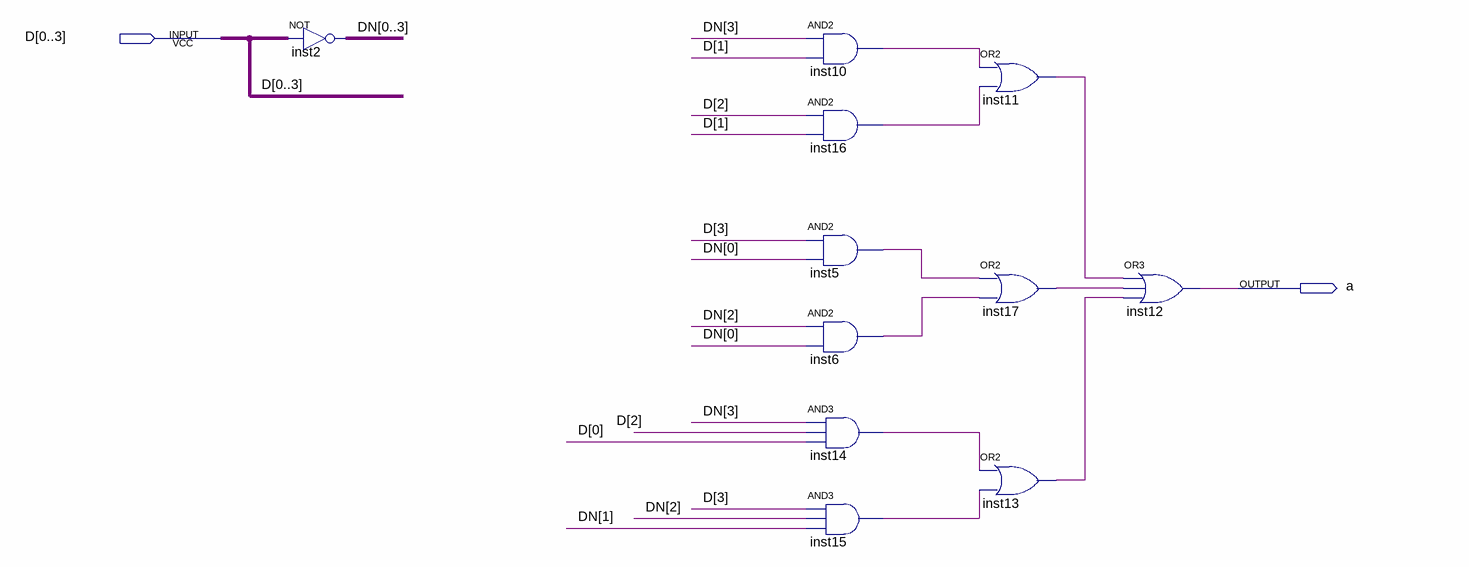
[diagram p0: schematic sheet]
// Quartus schematic d0.bdf as structural Verilog: 11 symbols, 2 pins
module d0 (
  input  [0:3] D,
  output a
);

  wire inst5_out, inst6_out, inst10_out, inst11_out, inst13_out, inst14_out, inst15_out, inst16_out,
       inst17_out;
  wire [3:0] DN;

  assign {DN[0], DN[1], DN[2], DN[3]} = ~D;  // NOT inst2, 4 bits wide
  and inst10 (inst10_out, DN[3], D[1]);
  and inst16 (inst16_out, D[2], D[1]);
  and inst5 (inst5_out, D[3], DN[0]);
  and inst6 (inst6_out, DN[2], DN[0]);
  and inst14 (inst14_out, DN[3], D[2], D[0]);
  and inst15 (inst15_out, D[3], DN[2], DN[1]);
  or inst11 (inst11_out, inst10_out, inst16_out);
  or inst17 (inst17_out, inst5_out, inst6_out);
  or inst13 (inst13_out, inst14_out, inst15_out);
  or inst12 (a, inst11_out, inst17_out, inst13_out);
endmodule
